# Altium schematic sheet CRAFT_E_Stop_AJeffersonRev2.SchDoc
size A
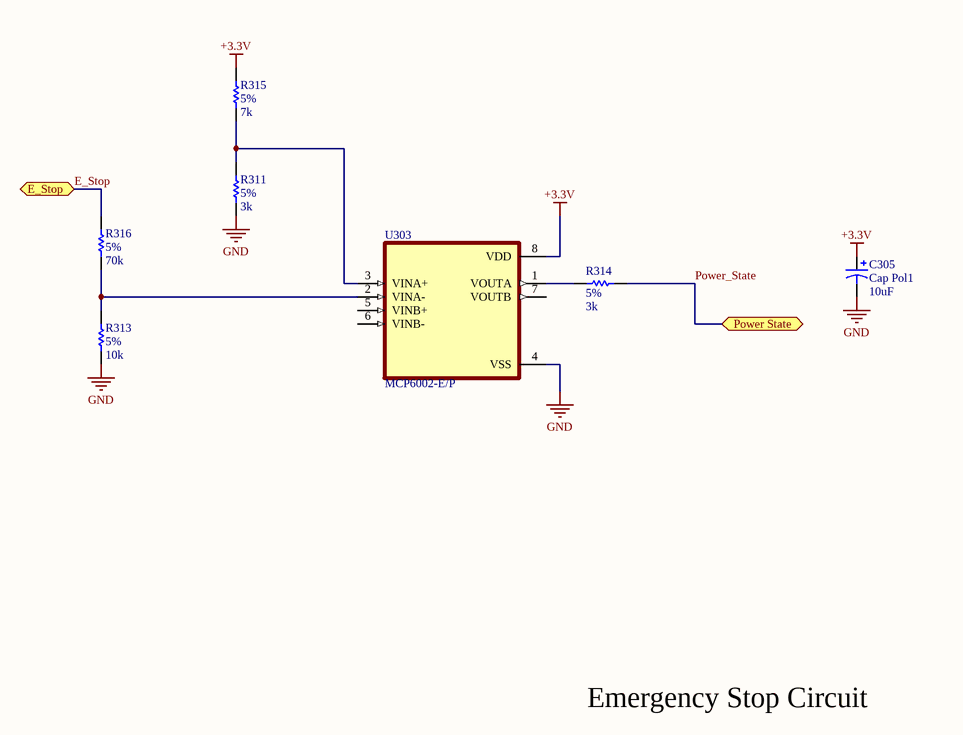
[diagram p0: CRAFT_E_Stop_AJeffersonRev2.SchDoc]

## Parts
C305  Cap Pol1  value 10uF  [CAPPRD250W50D630H1120]
R311  5%  value 3k  [AXIAL-0.3]
R313  5%  value 10k  [AXIAL-0.3]
R314  5%  value 3k  [AXIAL-0.3]
R315  5%  value 7k  [AXIAL-0.3]
R316  5%  value 70k  [AXIAL-0.3]
U303  MCP6002-E/P  [DIP787W46P254L927H533Q8]

## Ports
E_Stop, Power State (bidir)

## Nets
+3.3V: C305.1 R315.2 U303.8(VDD)
GND: C305.2 R311.1 R313.1 U303.4(VSS)
E_Stop: R316.2 ; port E_Stop
Power_State: R314.2 ; port Power State
NetR311_2: R311.2 R315.1 U303.3(VINA+)
NetR313_2: R313.2 R316.1 U303.2(VINA-)
NetR314_1: R314.1 U303.1(VOUTA)

Not connected (* = marked no-connect by the designer): U303 5(VINB+) 6(VINB-) 7(VOUTB)

## Notes on the sheet
- Emergency Stop Circuit

## Library data of the parts
C305 = Cap Pol1: Polarized Capacitor (Radial); pin to pad: 1>P 2>N; Published: 8-Jun-2000; LatestRevisionDate: 17-Jul-2002; LatestRevisionNote: Re-released for DXP Platform.; PackageReference: RB7.6-15; Publisher: Altium Limited; PackageDescription: Polarized Capacitor (Radial); 2 Leads
R311 R313-R316 = Res1: Resistor; Published: 8-Jun-2000; LatestRevisionDate: 17-Jul-2002; LatestRevisionNote: Re-released for DXP Platform.; PackageReference: AXIAL-0.3; Publisher: Altium Limited; PackageDescription: Axial Device, Thru-Hole; 2 Leads; 0.3 in Pin Spacing
U303 = MCP6002-E/P: General Purpose Amplifier 2 Circuit Rail-to-Rail 8-PDIP; MF: Microchip; Value: *; Availability: Unavailable; Price: None; MP: MCP6002-E/P; Package: DIP-8 Microchip; SnapEDA_Link: https://www.snapeda.com/parts/MCP6002-E/P/Microchip/view-part/228325/?ref=snap